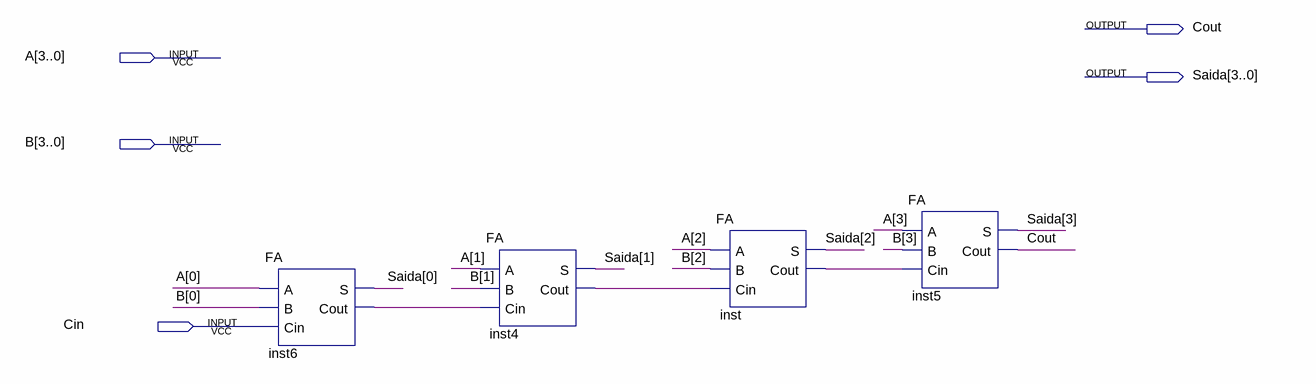
[diagram p0: schematic sheet]
// Quartus schematic rca.bdf as structural Verilog: 4 symbols, 5 pins
module rca (
  input  [3:0] A,
  input  [3:0] B,
  input  Cin,
  output Cout,
  output [3:0] Saida
);

  wire inst4_cout, inst6_cout, inst_cout;

  FA inst6 (.A(A[0]), .B(B[0]), .Cin(Cin), .S(Saida[0]), .Cout(inst6_cout));
  FA inst4 (.A(A[1]), .B(B[1]), .Cin(inst6_cout), .S(Saida[1]), .Cout(inst4_cout));
  FA inst (.A(A[2]), .B(B[2]), .Cin(inst4_cout), .S(Saida[2]), .Cout(inst_cout));
  FA inst5 (.A(A[3]), .B(B[3]), .Cin(inst_cout), .S(Saida[3]), .Cout(Cout));
endmodule
